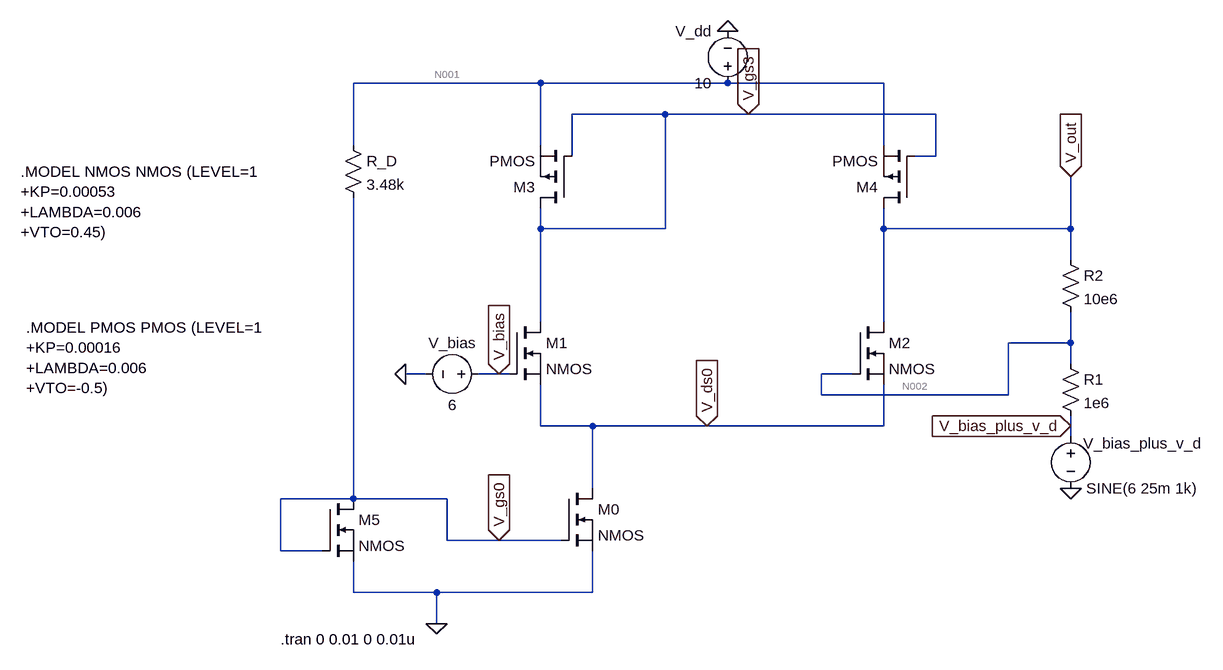
[diagram p0: schematic Q3_b.asc]
Q3_b.asc, the LTspice schematic file:
Version 4
SHEET 1 1368 920
WIRE 176 48 -112 48
WIRE 464 48 176 48
WIRE 704 48 464 48
WIRE 368 96 224 96
WIRE 496 96 368 96
WIRE 784 96 496 96
WIRE -112 144 -112 48
WIRE 176 144 176 48
WIRE 704 144 704 48
WIRE 224 160 224 96
WIRE 784 160 784 96
WIRE 784 160 752 160
WIRE 176 272 176 240
WIRE 368 272 368 96
WIRE 368 272 176 272
WIRE 704 272 704 240
WIRE 992 272 992 192
WIRE 992 272 704 272
WIRE 992 320 992 272
WIRE 176 416 176 272
WIRE 704 416 704 272
WIRE 992 448 992 400
WIRE 992 448 896 448
WIRE 992 480 992 448
WIRE 0 496 -32 496
WIRE 112 496 80 496
WIRE 128 496 112 496
WIRE 656 496 608 496
WIRE 608 528 608 496
WIRE 896 528 896 448
WIRE 896 528 608 528
WIRE 176 576 176 512
WIRE 256 576 176 576
WIRE 432 576 256 576
WIRE 704 576 704 512
WIRE 704 576 432 576
WIRE 992 576 992 560
WIRE 992 592 992 576
WIRE 256 672 256 576
WIRE -112 688 -112 224
WIRE -112 688 -224 688
WIRE 32 688 -112 688
WIRE 32 752 32 688
WIRE 112 752 32 752
WIRE 208 752 112 752
WIRE -224 768 -224 688
WIRE -160 768 -224 768
WIRE -112 832 -112 784
WIRE 16 832 -112 832
WIRE 256 832 256 768
WIRE 256 832 16 832
WIRE 16 880 16 832
FLAG 16 880 0
FLAG 464 -32 0
FLAG -32 496 0
FLAG 112 752 V_gs0
IOPIN 112 752 In
FLAG 432 576 V_ds0
IOPIN 432 576 In
FLAG 496 96 V_gs3
IOPIN 496 96 In
FLAG 112 496 V_bias
IOPIN 112 496 In
FLAG 992 192 V_out
IOPIN 992 192 In
FLAG 992 672 0
FLAG 992 576 V_bias_plus_v_d
IOPIN 992 576 In
SYMBOL voltage 464 64 R180
WINDOW 0 24 96 Left 2
WINDOW 3 24 16 Left 2
WINDOW 123 0 0 Left 0
WINDOW 39 0 0 Left 0
SYMATTR InstName V_dd
SYMATTR Value 10
SYMBOL nmos 208 672 R0
SYMATTR InstName M0
SYMBOL nmos -160 688 R0
SYMATTR InstName M5
SYMBOL nmos 128 416 R0
SYMATTR InstName M1
SYMBOL nmos 656 416 R0
SYMATTR InstName M2
SYMBOL res -128 128 R0
SYMATTR InstName R_D
SYMATTR Value 3.48k
SYMBOL voltage 96 496 R90
WINDOW 0 -32 56 VBottom 2
WINDOW 3 32 56 VTop 2
WINDOW 123 0 0 Left 0
WINDOW 39 0 0 Left 0
SYMATTR InstName V_bias
SYMATTR Value 6
SYMBOL pmos 224 240 R180
SYMATTR InstName M3
SYMBOL pmos 752 240 R180
SYMATTR InstName M4
SYMBOL res 976 304 R0
SYMATTR InstName R2
SYMATTR Value 10e6
SYMBOL res 976 464 R0
SYMATTR InstName R1
SYMATTR Value 1e6
SYMBOL voltage 992 576 R0
WINDOW 0 19 27 Left 2
WINDOW 123 0 0 Left 0
WINDOW 39 0 0 Left 0
SYMATTR InstName V_bias_plus_v_d
SYMATTR Value SINE(6 25m 1k)
TEXT -624 184 Left 2 !.MODEL NMOS NMOS (LEVEL=1 \n+KP=0.00053\n+LAMBDA=0.006\n+VTO=0.45)
TEXT -616 424 Left 2 !.MODEL PMOS PMOS (LEVEL=1 \n+KP=0.00016\n+LAMBDA=0.006\n+VTO=-0.5)
TEXT -224 904 Left 2 !.tran 0 0.01 0 0.01u

The netlist it stands for:
* Q3_b.asc
V_dd N001 0 10
M0 V_ds0 V_gs0 0 0 NMOS
M5 V_gs0 V_gs0 0 0 NMOS
M1 V_gs3 V_bias V_ds0 V_ds0 NMOS
M2 V_out N002 V_ds0 V_ds0 NMOS
R_D N001 V_gs0 3.48k
V_bias V_bias 0 6
M3 V_gs3 V_gs3 N001 N001 PMOS
M4 V_out V_gs3 N001 N001 PMOS
R2 V_out N002 10e6
R1 N002 V_bias_plus_v_d 1e6
V_bias_plus_v_d V_bias_plus_v_d 0 SINE(6 25m 1k)
.model NMOS NMOS
.model PMOS PMOS
.lib standard.mos
.MODEL NMOS NMOS (LEVEL=1
+KP=0.00053
+LAMBDA=0.006
+VTO=0.45)
.MODEL PMOS PMOS (LEVEL=1
+KP=0.00016
+LAMBDA=0.006
+VTO=-0.5)
.tran 0 0.01 0 0.01u
.backanno
.end

* Results of the author's LTspice run, read from the files saved beside the schematic
* Operating Point, zero values left out:
*   V(n001) = 10 V
*   V(v_ds0) = 3.634 V
*   V(v_gs0) = 3.15 V
*   V(v_gs3) = 6.029 V
*   V(v_bias) = 6 V
*   V(v_out) = 6.003 V
*   V(n002) = 6 V
*   V(v_bias_plus_v_d) = 6 V
*   Id(M0) = 1.974 mA
*   Ib(M0) = -3.644 pA
*   Is(M0) = -1.974 mA
*   Id(M5) = 1.968 mA
*   Ib(M5) = -3.16 pA
*   Is(M5) = -1.968 mA
*   Id(M1) = 986.9 µA
*   Ib(M1) = -2.405 pA
*   Is(M1) = -986.9 µA
*   Id(M2) = 987.1 µA
*   Ib(M2) = -2.379 pA
*   Is(M2) = -987.1 µA
*   Id(M3) = -986.9 µA
*   Ib(M3) = 3.981 pA
*   Is(M3) = 986.9 µA
*   Id(M4) = -987.1 µA
*   Ib(M4) = 4.007 pA
*   Is(M4) = 987.1 µA
*   I(R_d) = 1.968 mA
*   I(R2) = 288.5 pA
*   I(R1) = 288.5 pA
*   I(V_dd) = -3.942 mA
*   I(V_bias_plus_v_d) = 288.5 pA
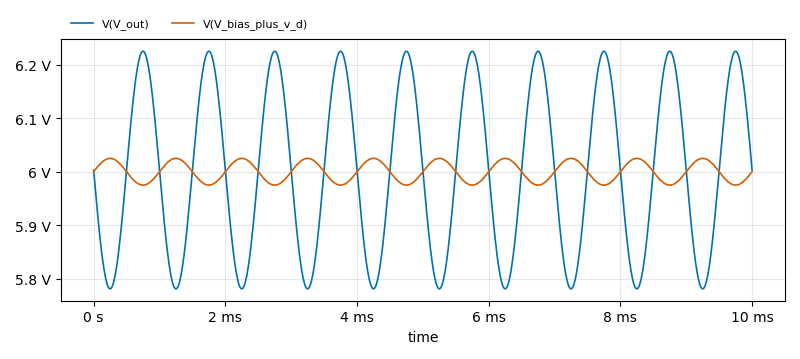
[diagram p1: Transient Analysis of Q3_b.asc, plotted from the saved traces]
* Transient Analysis, 1 run:
*   V(V_out): min 5.781 V, max 6.225 V, average 6.003 V, rms 6.005 V, last 6.003 V
*   V(V_bias_plus_v_d): min 5.975 V, max 6.025 V, average 6 V, rms 6 V, last 6 V